# Altium schematic sheet DAC_board.SchDoc
size A4; DocumentNumber: 2; SheetNumber: 2; SheetTotal: 9
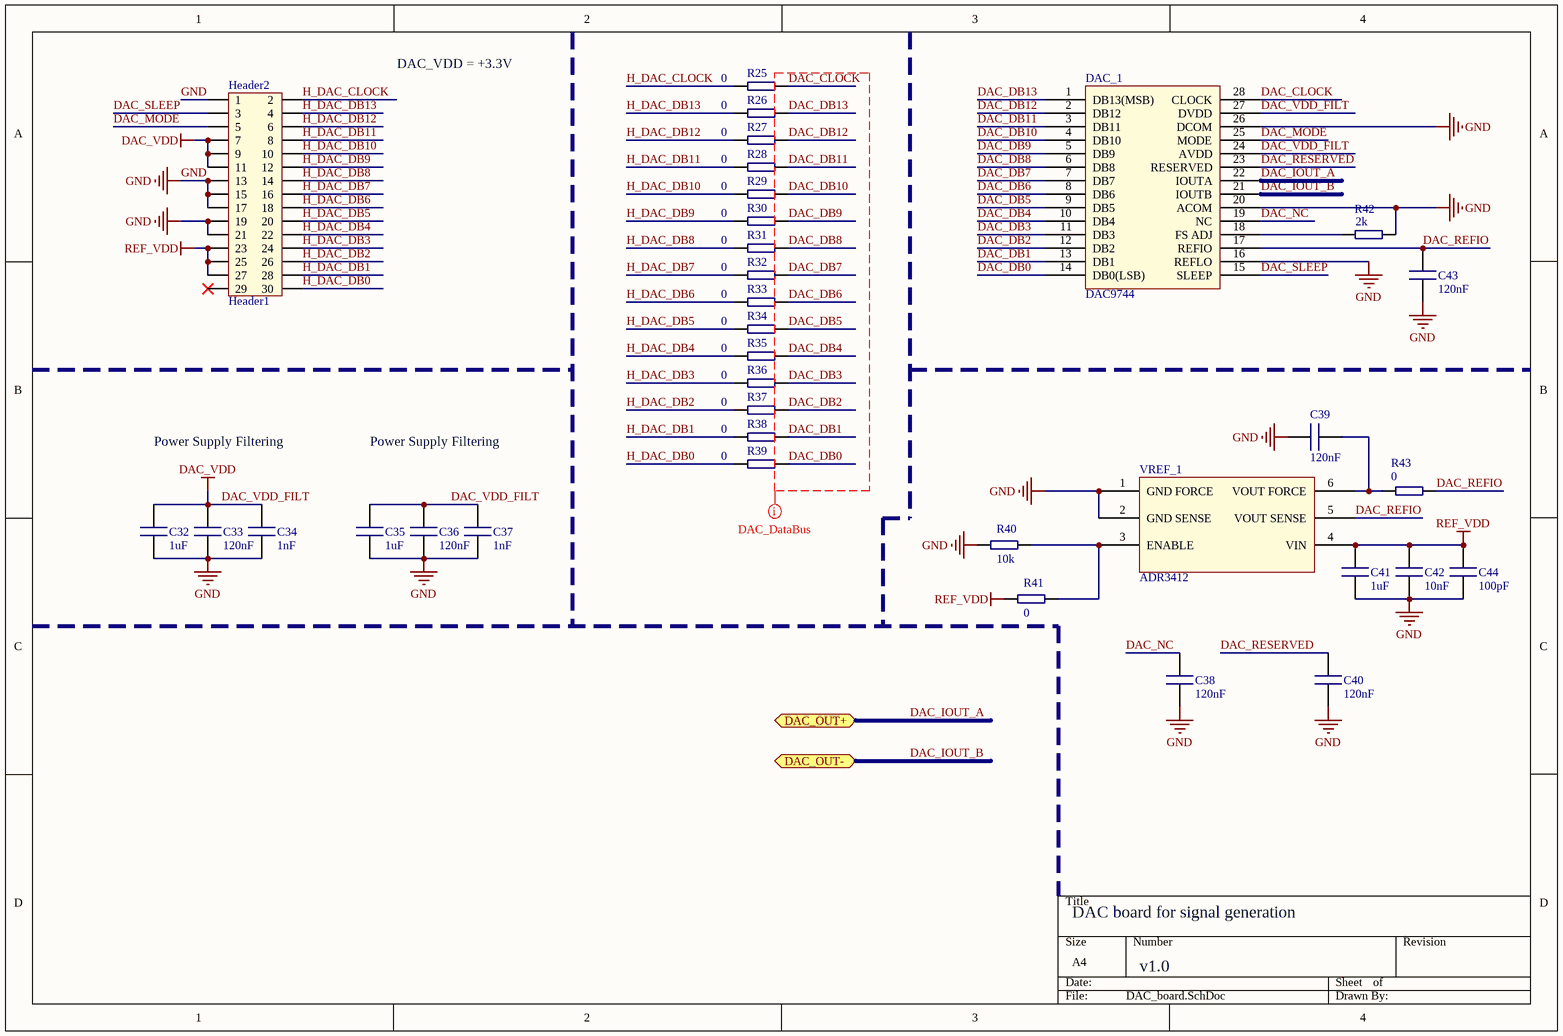
[diagram p0: DAC_board.SchDoc]

## Parts
C32  value 1uF  [0805 SMD Passive]  (hidden comment: Cap1)
C33  value 120nF  [0805 SMD Passive]  (hidden comment: Cap1)
C34  value 1nF  [0805 SMD Passive]  (hidden comment: Cap1)
C35  value 1uF  [0805 SMD Passive]  (hidden comment: Cap1)
C36  value 120nF  [0805 SMD Passive]  (hidden comment: Cap1)
C37  value 1nF  [0805 SMD Passive]  (hidden comment: Cap1)
C38  value 120nF  [0805 SMD Passive]  (hidden comment: Cap1)
C39  value 120nF  [0805 SMD Passive]  (hidden comment: Cap1)
C40  value 120nF  [0805 SMD Passive]  (hidden comment: Cap1)
C41  value 1uF  [0805 SMD Passive]  (hidden comment: Cap1)
C42  value 10nF  [0805 SMD Passive]  (hidden comment: Cap1)
C43  value 120nF  [0805 SMD Passive]  (hidden comment: Cap1)
C44  value 100pF  [0805 SMD Passive]  (hidden comment: Cap1)
DAC_1  DAC9744  [AD9744]
Header2  Header1  [Header1]
R25  value 0  [0805 SMD Passive]  (hidden comment: Resistor)
R26  value 0  [0805 SMD Passive]  (hidden comment: Resistor)
R27  value 0  [0805 SMD Passive]  (hidden comment: Resistor)
R28  value 0  [0805 SMD Passive]  (hidden comment: Resistor)
R29  value 0  [0805 SMD Passive]  (hidden comment: Resistor)
R30  value 0  [0805 SMD Passive]  (hidden comment: Resistor)
R31  value 0  [0805 SMD Passive]  (hidden comment: Resistor)
R32  value 0  [0805 SMD Passive]  (hidden comment: Resistor)
R33  value 0  [0805 SMD Passive]  (hidden comment: Resistor)
R34  value 0  [0805 SMD Passive]  (hidden comment: Resistor)
R35  value 0  [0805 SMD Passive]  (hidden comment: Resistor)
R36  value 0  [0805 SMD Passive]  (hidden comment: Resistor)
R37  value 0  [0805 SMD Passive]  (hidden comment: Resistor)
R38  value 0  [0805 SMD Passive]  (hidden comment: Resistor)
R39  value 0  [0805 SMD Passive]  (hidden comment: Resistor)
R40  value 10k  [0805 SMD Passive]  (hidden comment: Resistor)
R41  value 0  [0805 SMD Passive]  (hidden comment: Resistor)
R42  value 2k  [0805 SMD Passive]  (hidden comment: Resistor)
R43  value 0  [0805 SMD Passive]  (hidden comment: Resistor)
VREF_1  ADR3412  [ADR3412]

## Ports
DAC_OUT+, DAC_OUT-

## Nets
DAC_VDD_FILT: C32.1 C33.1 C34.1 C35.1 C36.1 C37.1 DAC_1.24(AVDD) DAC_1.27(DVDD) Header2.7 Header2.9 Header2.11  [also labelled DAC_VDD]
GND: C32.2 C33.2 C34.2 C35.2 C36.2 C37.2 C38.2 C39.2 C40.2 C41.2 C42.2 C43.2 C44.2 DAC_1.16(REFLO) DAC_1.20(ACOM) DAC_1.26(DCOM) Header2.1 Header2.13 Header2.15 Header2.17 Header2.19 Header2.21 R40.2 R42.2 VREF_1.1(GND_FORCE) VREF_1.2(GND_SENSE)
REF_VDD: C41.1 C42.1 C44.1 Header2.23 Header2.25 Header2.27 R41.2 VREF_1.4(VIN)
DAC_CLOCK: DAC_1.28(CLOCK) R25.2
DAC_DB0: DAC_1.14(DB0(LSB)) R39.2
DAC_DB1: DAC_1.13(DB1) R38.2
DAC_DB2: DAC_1.12(DB2) R37.2
DAC_DB3: DAC_1.11(DB3) R36.2
DAC_DB4: DAC_1.10(DB4) R35.2
DAC_DB5: DAC_1.9(DB5) R34.2
DAC_DB6: DAC_1.8(DB6) R33.2
DAC_DB7: DAC_1.7(DB7) R32.2
DAC_DB8: DAC_1.6(DB8) R31.2
DAC_DB9: DAC_1.5(DB9) R30.2
DAC_DB10: DAC_1.4(DB10) R29.2
DAC_DB11: DAC_1.3(DB11) R28.2
DAC_DB12: DAC_1.2(DB12) R27.2
DAC_DB13: DAC_1.1(DB13(MSB)) R26.2
DAC_IOUT_A: DAC_1.22(IOUTA) ; port DAC_OUT+
DAC_IOUT_B: DAC_1.21(IOUTB) ; port DAC_OUT-
DAC_MODE: DAC_1.25(MODE) Header2.5
DAC_NC: C38.1 DAC_1.19(NC)
DAC_REFIO: C43.1 DAC_1.17(REFIO) R43.2 VREF_1.5(VOUT_SENSE)
DAC_RESERVED: C40.1 DAC_1.23(RESERVED)
DAC_SLEEP: DAC_1.15(SLEEP) Header2.3
H_DAC_CLOCK: Header2.2 R25.1
H_DAC_DB0: Header2.30 R39.1
H_DAC_DB1: Header2.28 R38.1
H_DAC_DB2: Header2.26 R37.1
H_DAC_DB3: Header2.24 R36.1
H_DAC_DB4: Header2.22 R35.1
H_DAC_DB5: Header2.20 R34.1
H_DAC_DB6: Header2.18 R33.1
H_DAC_DB7: Header2.16 R32.1
H_DAC_DB8: Header2.14 R31.1
H_DAC_DB9: Header2.12 R30.1
H_DAC_DB10: Header2.10 R29.1
H_DAC_DB11: Header2.8 R28.1
H_DAC_DB12: Header2.6 R27.1
H_DAC_DB13: Header2.4 R26.1
NetC39_1: C39.1 R43.1 VREF_1.6(VOUT_FORCE)
NetDAC_1_18: DAC_1.18(FS_ADJ) R42.1
NetR40_1: R40.1 R41.1 VREF_1.3(ENABLE)

Not connected (* = marked no-connect by the designer): Header2 29*

## Layout directives
net class DAC_DataBus: DAC_CLOCK, DAC_DB0, DAC_DB1, DAC_DB2, DAC_DB3, DAC_DB4, DAC_DB5, DAC_DB6, DAC_DB7, DAC_DB8, DAC_DB9, DAC_DB10, DAC_DB11, DAC_DB12, DAC_DB13

## Notes on the sheet
- DAC_VDD = +3.3V
- Power Supply Filtering
- DAC board for signal generation
- v1.0

## Library data of the parts
C32-C44 = Cap1: SMD Capacitor; Precision: 1%; MaxVolt: 16V; FootPrint: *
DAC_1 = AD9744: Digital Analog Converter; Manufacturer: Analog Devices; Order Code: AD9744ARZ; Package Description: 28-Lead TSSOP; PartNumber: AD9744
Header2 = Header1: 29 Pin Header; PartNumber: TLW-115-01-G-D-002-RA; Manufacterer: Samtec; PinNumber: 29; Row: 2; Pitch: 2.54mm; Type: 90°
R25-R43 = Res1: SMD Resistor; Precision: 1%; MaxPower: 0.1W; FootPrint: SMD
VREF_1 = ADR3412: 1.2 Voltage Ref Source; Manufacturer: Analog Devices; Order Code: ADR3412ARJZ-R2; Package Description: 6-Lead SOT-23; PartNumber: ADR3412